# Altium schematic sheet Ada - Base Block - Cover sheet Issue 4.0.SchDoc: Title
size A3; DrawnBy: Name; DocumentNumber: 1; Revision: A; SheetNumber: 1; SheetTotal: 4
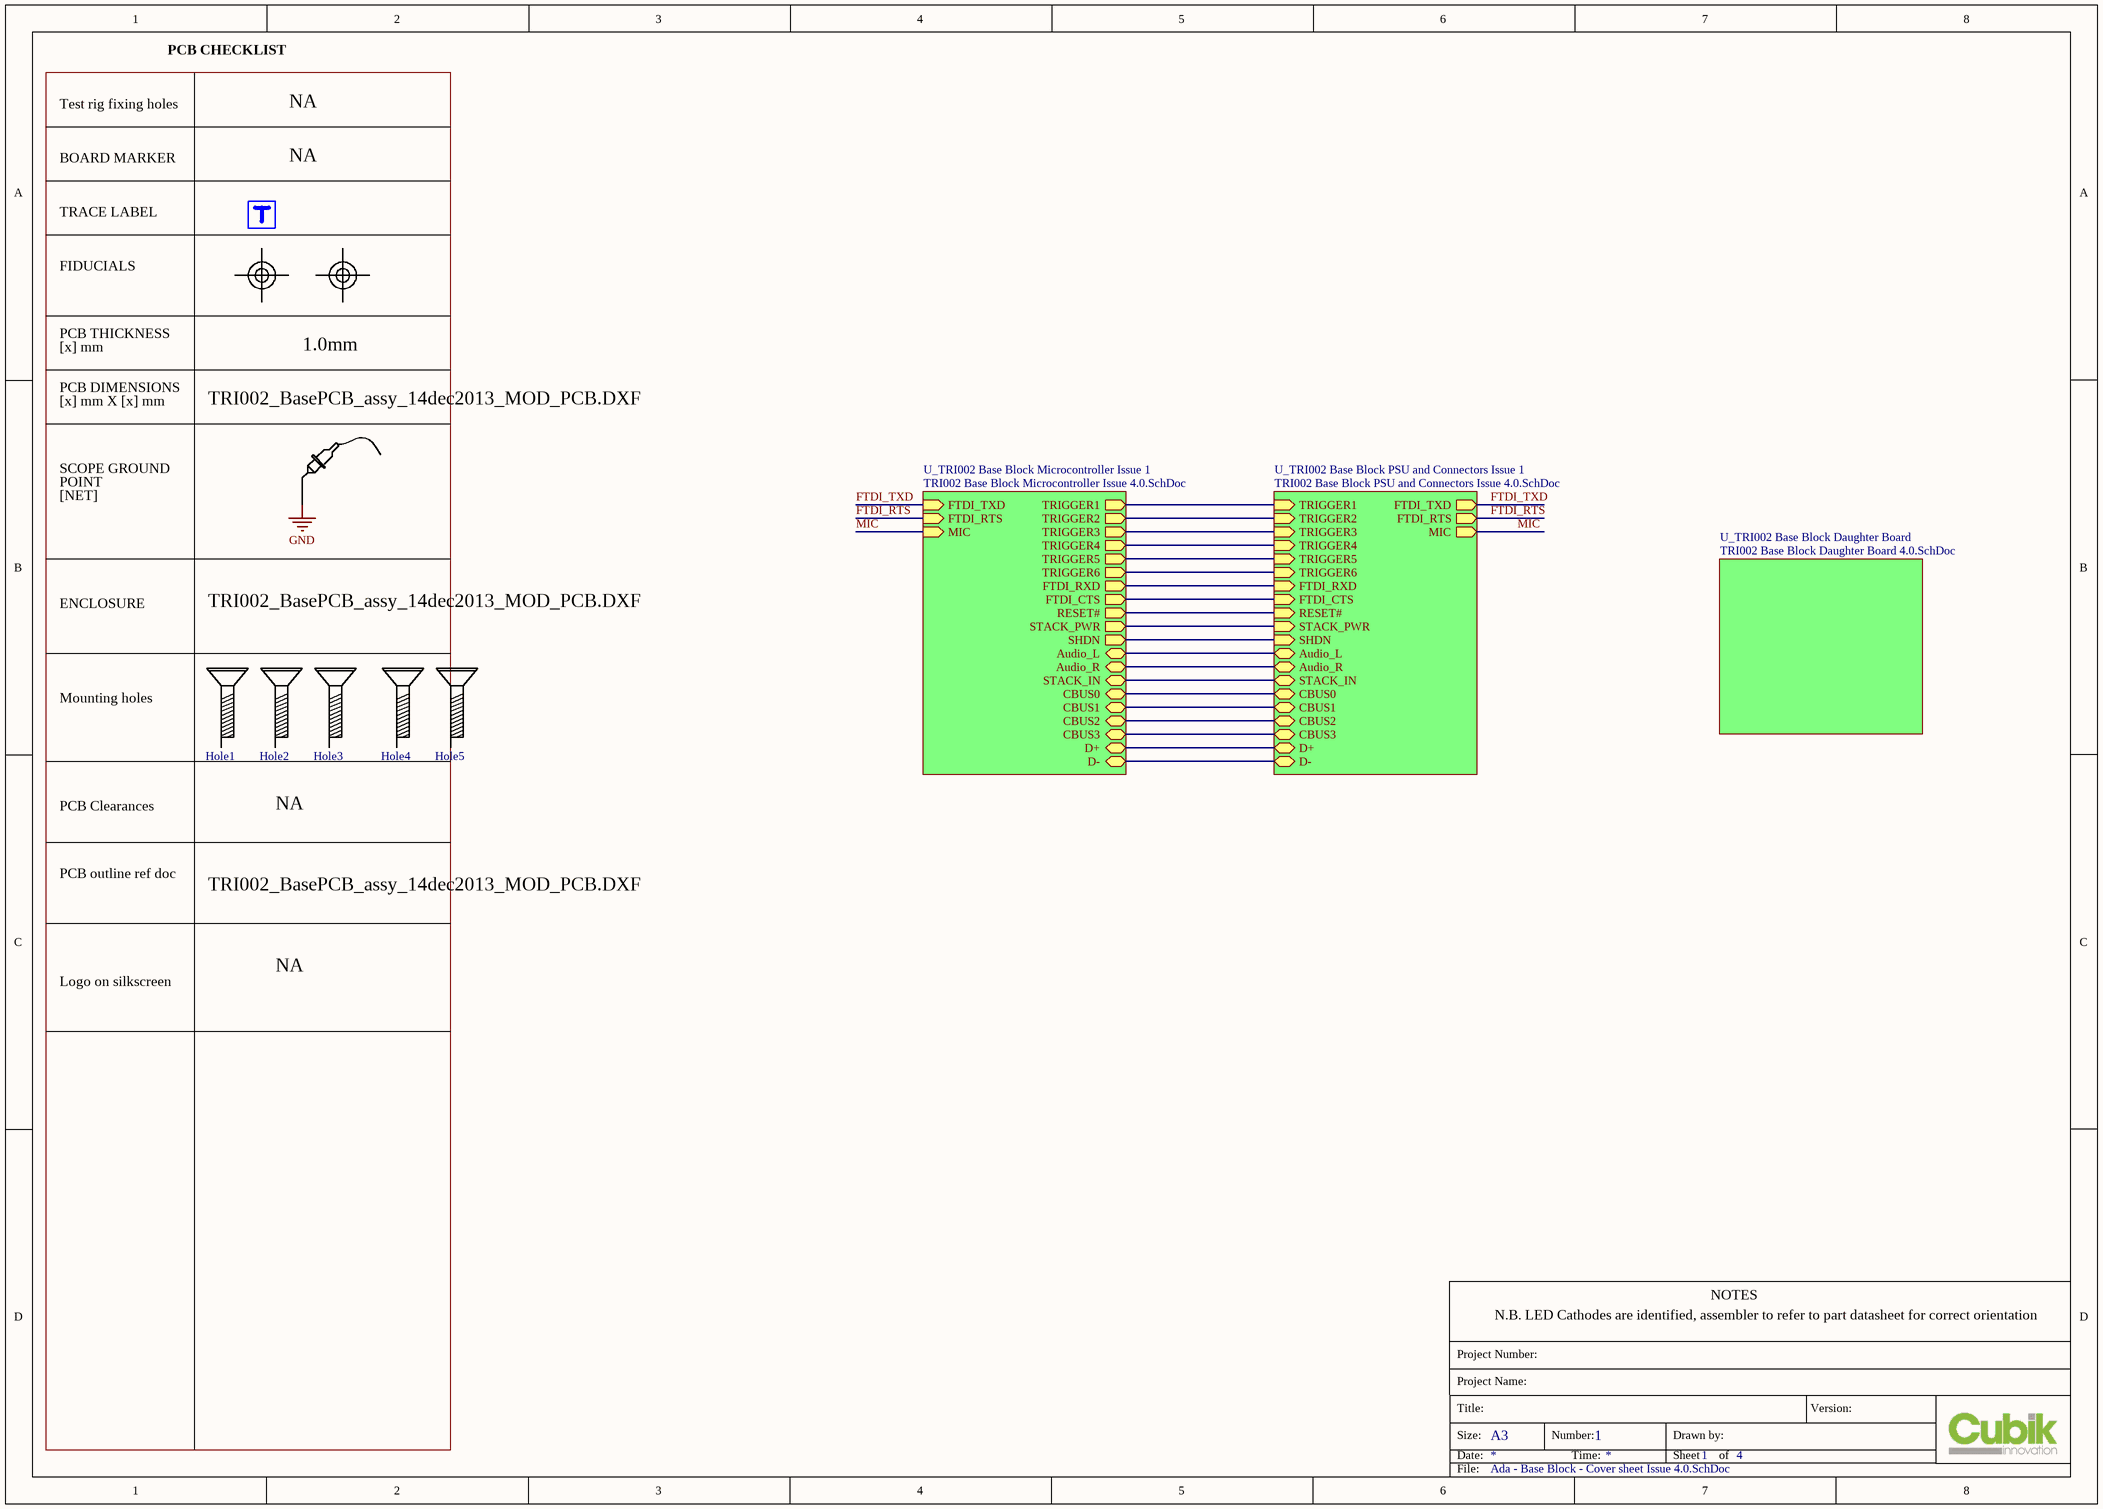
[diagram p0: Ada - Base Block - Cover sheet Issue 4.0.SchDoc]

## Parts
Fiducial_1  Fiducial  [FMARK]  (value not drawn)  (no BOM)
Fiducial_2  Fiducial  [FMARK]  (value not drawn)  (no BOM)
Hole1  3mm Mounting hole  [3mm mounting hole]  (value not drawn)  (no BOM)
Hole2  3mm Mounting hole  [3mm mounting hole]  (value not drawn)  (no BOM)
Hole3  3mm Mounting hole  [3mm mounting hole]  (value not drawn)  (no BOM)
Hole4  3mm Mounting hole  [3mm mounting hole]  (value not drawn)  (no BOM)
Hole5  3mm Mounting hole  [3mm mounting hole]  (value not drawn)  (no BOM)
SP  Scope GND point  [Scope GND point]  (value not drawn)  (no BOM)
TR1  trace label  [TraceLabel]  (value not drawn)  (no BOM)

## Sub-sheets
U_TRI002 Base Block Daughter Board = TRI002 Base Block Daughter Board 4.0.SchDoc: no entries
U_TRI002 Base Block Microcontroller Issue 1 = TRI002 Base Block Microcontroller Issue 4.0.SchDoc: Audio_L (bidir), Audio_R (bidir), D+ (bidir), D- (bidir), TRIGGER1 (out), TRIGGER2 (out), TRIGGER3 (out), TRIGGER4 (out), TRIGGER5 (out), TRIGGER6 (out), FTDI_TXD (in), FTDI_RXD (out), FTDI_RTS (in), FTDI_CTS (out), CBUS0 (bidir), CBUS1 (bidir), CBUS2 (bidir), CBUS3 (bidir), RESET# (out), MIC (in), STACK_IN (bidir), SHDN (out), STACK_PWR (out)
U_TRI002 Base Block PSU and Connectors Issue 1 = TRI002 Base Block PSU and Connectors Issue 4.0.SchDoc: FTDI_TXD (out), FTDI_RXD (in), FTDI_RTS (out), FTDI_CTS (in), CBUS0 (bidir), CBUS1 (bidir), CBUS2 (bidir), CBUS3 (bidir), D+ (bidir), D- (bidir), RESET# (in), TRIGGER1 (in), TRIGGER2 (in), TRIGGER3 (in), TRIGGER4 (in), TRIGGER5 (in), TRIGGER6 (in), Audio_L (bidir), Audio_R (bidir), MIC (out), STACK_IN (bidir), SHDN (in), STACK_PWR (in)

## Nets
GND: SP.1
FTDI_RTS: sheet U_TRI002 Base Block Microcontroller Issue 1/FTDI_RTS, sheet U_TRI002 Base Block PSU and Connectors Issue 1/FTDI_RTS
FTDI_TXD: sheet U_TRI002 Base Block Microcontroller Issue 1/FTDI_TXD, sheet U_TRI002 Base Block PSU and Connectors Issue 1/FTDI_TXD
MIC: sheet U_TRI002 Base Block Microcontroller Issue 1/MIC, sheet U_TRI002 Base Block PSU and Connectors Issue 1/MIC
(unnamed): sheet U_TRI002 Base Block Microcontroller Issue 1/Audio_L, sheet U_TRI002 Base Block PSU and Connectors Issue 1/Audio_L
(unnamed): sheet U_TRI002 Base Block Microcontroller Issue 1/Audio_R, sheet U_TRI002 Base Block PSU and Connectors Issue 1/Audio_R
(unnamed): sheet U_TRI002 Base Block Microcontroller Issue 1/D+, sheet U_TRI002 Base Block PSU and Connectors Issue 1/D+
(unnamed): sheet U_TRI002 Base Block Microcontroller Issue 1/D-, sheet U_TRI002 Base Block PSU and Connectors Issue 1/D-
(unnamed): sheet U_TRI002 Base Block Microcontroller Issue 1/TRIGGER1, sheet U_TRI002 Base Block PSU and Connectors Issue 1/TRIGGER1
(unnamed): sheet U_TRI002 Base Block Microcontroller Issue 1/TRIGGER2, sheet U_TRI002 Base Block PSU and Connectors Issue 1/TRIGGER2
(unnamed): sheet U_TRI002 Base Block Microcontroller Issue 1/TRIGGER3, sheet U_TRI002 Base Block PSU and Connectors Issue 1/TRIGGER3
(unnamed): sheet U_TRI002 Base Block Microcontroller Issue 1/TRIGGER4, sheet U_TRI002 Base Block PSU and Connectors Issue 1/TRIGGER4
(unnamed): sheet U_TRI002 Base Block Microcontroller Issue 1/TRIGGER5, sheet U_TRI002 Base Block PSU and Connectors Issue 1/TRIGGER5
(unnamed): sheet U_TRI002 Base Block Microcontroller Issue 1/TRIGGER6, sheet U_TRI002 Base Block PSU and Connectors Issue 1/TRIGGER6
(unnamed): sheet U_TRI002 Base Block Microcontroller Issue 1/FTDI_RXD, sheet U_TRI002 Base Block PSU and Connectors Issue 1/FTDI_RXD
(unnamed): sheet U_TRI002 Base Block Microcontroller Issue 1/FTDI_CTS, sheet U_TRI002 Base Block PSU and Connectors Issue 1/FTDI_CTS
(unnamed): sheet U_TRI002 Base Block Microcontroller Issue 1/CBUS0, sheet U_TRI002 Base Block PSU and Connectors Issue 1/CBUS0
(unnamed): sheet U_TRI002 Base Block Microcontroller Issue 1/CBUS1, sheet U_TRI002 Base Block PSU and Connectors Issue 1/CBUS1
(unnamed): sheet U_TRI002 Base Block Microcontroller Issue 1/CBUS2, sheet U_TRI002 Base Block PSU and Connectors Issue 1/CBUS2
(unnamed): sheet U_TRI002 Base Block Microcontroller Issue 1/CBUS3, sheet U_TRI002 Base Block PSU and Connectors Issue 1/CBUS3
(unnamed): sheet U_TRI002 Base Block Microcontroller Issue 1/RESET#, sheet U_TRI002 Base Block PSU and Connectors Issue 1/RESET#
(unnamed): sheet U_TRI002 Base Block Microcontroller Issue 1/STACK_IN, sheet U_TRI002 Base Block PSU and Connectors Issue 1/STACK_IN
(unnamed): sheet U_TRI002 Base Block Microcontroller Issue 1/SHDN, sheet U_TRI002 Base Block PSU and Connectors Issue 1/SHDN
(unnamed): sheet U_TRI002 Base Block Microcontroller Issue 1/STACK_PWR, sheet U_TRI002 Base Block PSU and Connectors Issue 1/STACK_PWR

Not connected (* = marked no-connect by the designer): Hole1 1; Hole2 1; Hole3 1; Hole4 1; Hole5 1

## Notes on the sheet
- NA
- 1.0mm
- TRI002_BasePCB_assy_14dec2013_MOD_PCB.DXF
- Test rig fixing holes
- PCB CHECKLIST
- BOARD MARKER
- TRACE LABEL
- FIDUCIALS
- PCB THICKNESS
- [x] mm
- PCB DIMENSIONS
- [x] mm X [x] mm
- SCOPE GROUND
- POINT
- [NET]
- ENCLOSURE
- Mounting holes
- PCB Clearances
- PCB outline ref doc
- Logo on silkscreen
- N.B. LED Cathodes are identified, assembler to refer to part datasheet for correct orientation
- NOTES
- Project Name:
- Project Number:
- Title:
- Size:
- Date:
- A3
- Number:
- Time:
- Sheet
- Drawn by:
- of
- Version:
- File:

## Library data of the parts
Fiducial_1 Fiducial_2 = F Mark: Value: Fiducial
SP = Scope GND point: Scope probe earth point